# Altium schematic sheet [8]-IR_BACKLIGHT.SchDoc
size A4
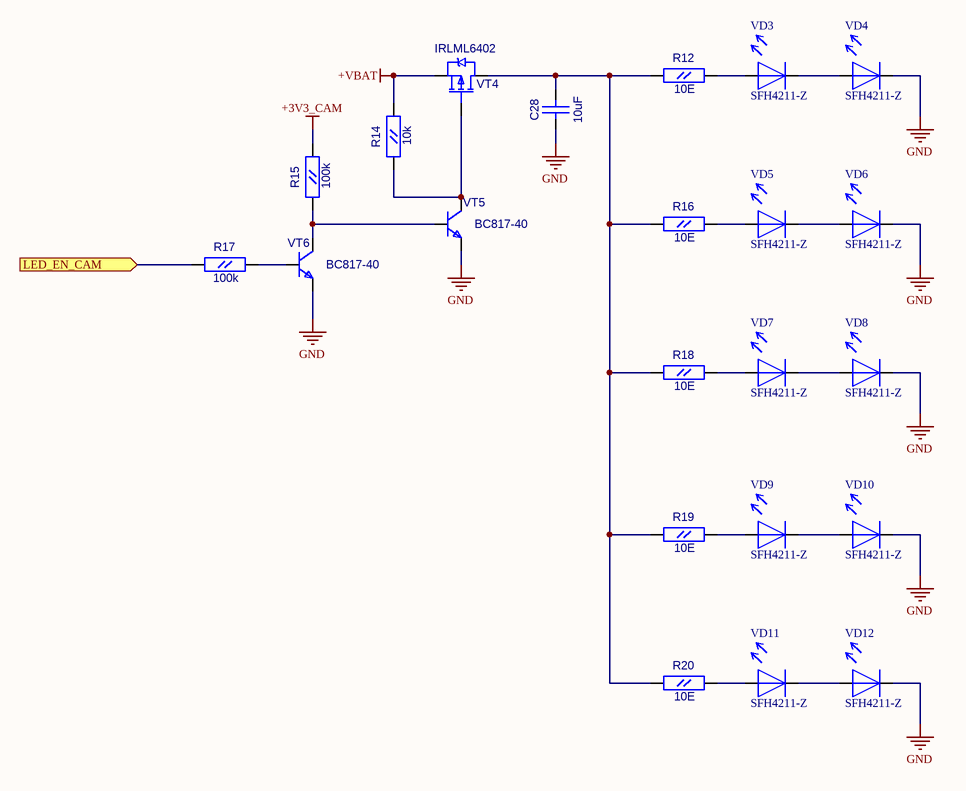
[diagram p0: [8]-IR_BACKLIGHT.SchDoc]

## Parts
C28  10uF  [CC0805]
R12  10E  [RC0603]
R14  10k  [RC0603]
R15  100k  [RC0603]
R16  10E  [RC0603]
R17  100k  [RC0603]
R18  10E  [RC0603]
R19  10E  [RC0603]
R20  10E  [RC0603]
VD3  SFH4211-Z  [LED_3528]
VD4  SFH4211-Z  [LED_3528]
VD5  SFH4211-Z  [LED_3528]
VD6  SFH4211-Z  [LED_3528]
VD7  SFH4211-Z  [LED_3528]
VD8  SFH4211-Z  [LED_3528]
VD9  SFH4211-Z  [LED_3528]
VD10  SFH4211-Z  [LED_3528]
VD11  SFH4211-Z  [LED_3528]
VD12  SFH4211-Z  [LED_3528]
VT4  IRLML6402  [SOT-23(123)]
VT5  BC817-40  [SOT-23(123)]
VT6  BC817-40  [SOT-23(123)]

## Ports
LED_EN_CAM (in)

## Nets
+3V3_CAM: R15.2(B)
+VBAT: R14.2(B) VT4.2(S)
GND: C28.1(A) VD4.2 VD6.2 VD8.2 VD10.2 VD12.2 VT5.2(E) VT6.2(E)
LED_EN_CAM: R17.1(A) ; port LED_EN_CAM
NetC28_2: C28.2(B) R12.1(A) R16.1(A) R18.1(A) R19.1(A) R20.1(A) VT4.3(D)
NetR12_2: R12.2(B) VD3.1
NetR14_1: R14.1(A) VT4.1(G) VT5.3(C)
NetR15_1: R15.1(A) VT5.1(B) VT6.3(C)
NetR16_2: R16.2(B) VD5.1
NetR17_2: R17.2(B) VT6.1(B)
NetR18_2: R18.2(B) VD7.1
NetR19_2: R19.2(B) VD9.1
NetR20_2: R20.2(B) VD11.1
NetVD3_2: VD3.2 VD4.1
NetVD5_2: VD5.2 VD6.1
NetVD7_2: VD7.2 VD8.1
NetVD9_2: VD9.2 VD10.1
NetVD11_2: VD11.2 VD12.1

## Library data of the parts
C28 = CC0805: Value: 10uF
R12 R14-R20 = RC0603
  R12 R16 R18-R20: Value: 10E
  R14: Value: 10k
  R15 R17: Value: 100k
VD3-VD12 = LED_3528: Value: SFH4211-Z
VT4 = IRLML6402: HEXFET Power MOSFET; OriginalName: IRLML5103; ComponentField7: Published 8-Jun-2000; Value: IRLML6402
VT5 VT6 = BC846BLT1: NPN 500ma transistor; ComponentField7: Published 29-Sep-2000; OriginalName: BC846BLT1; Value: BC817-40